# EAGLE schematic VU_meter (EAGLE 7.4.0)
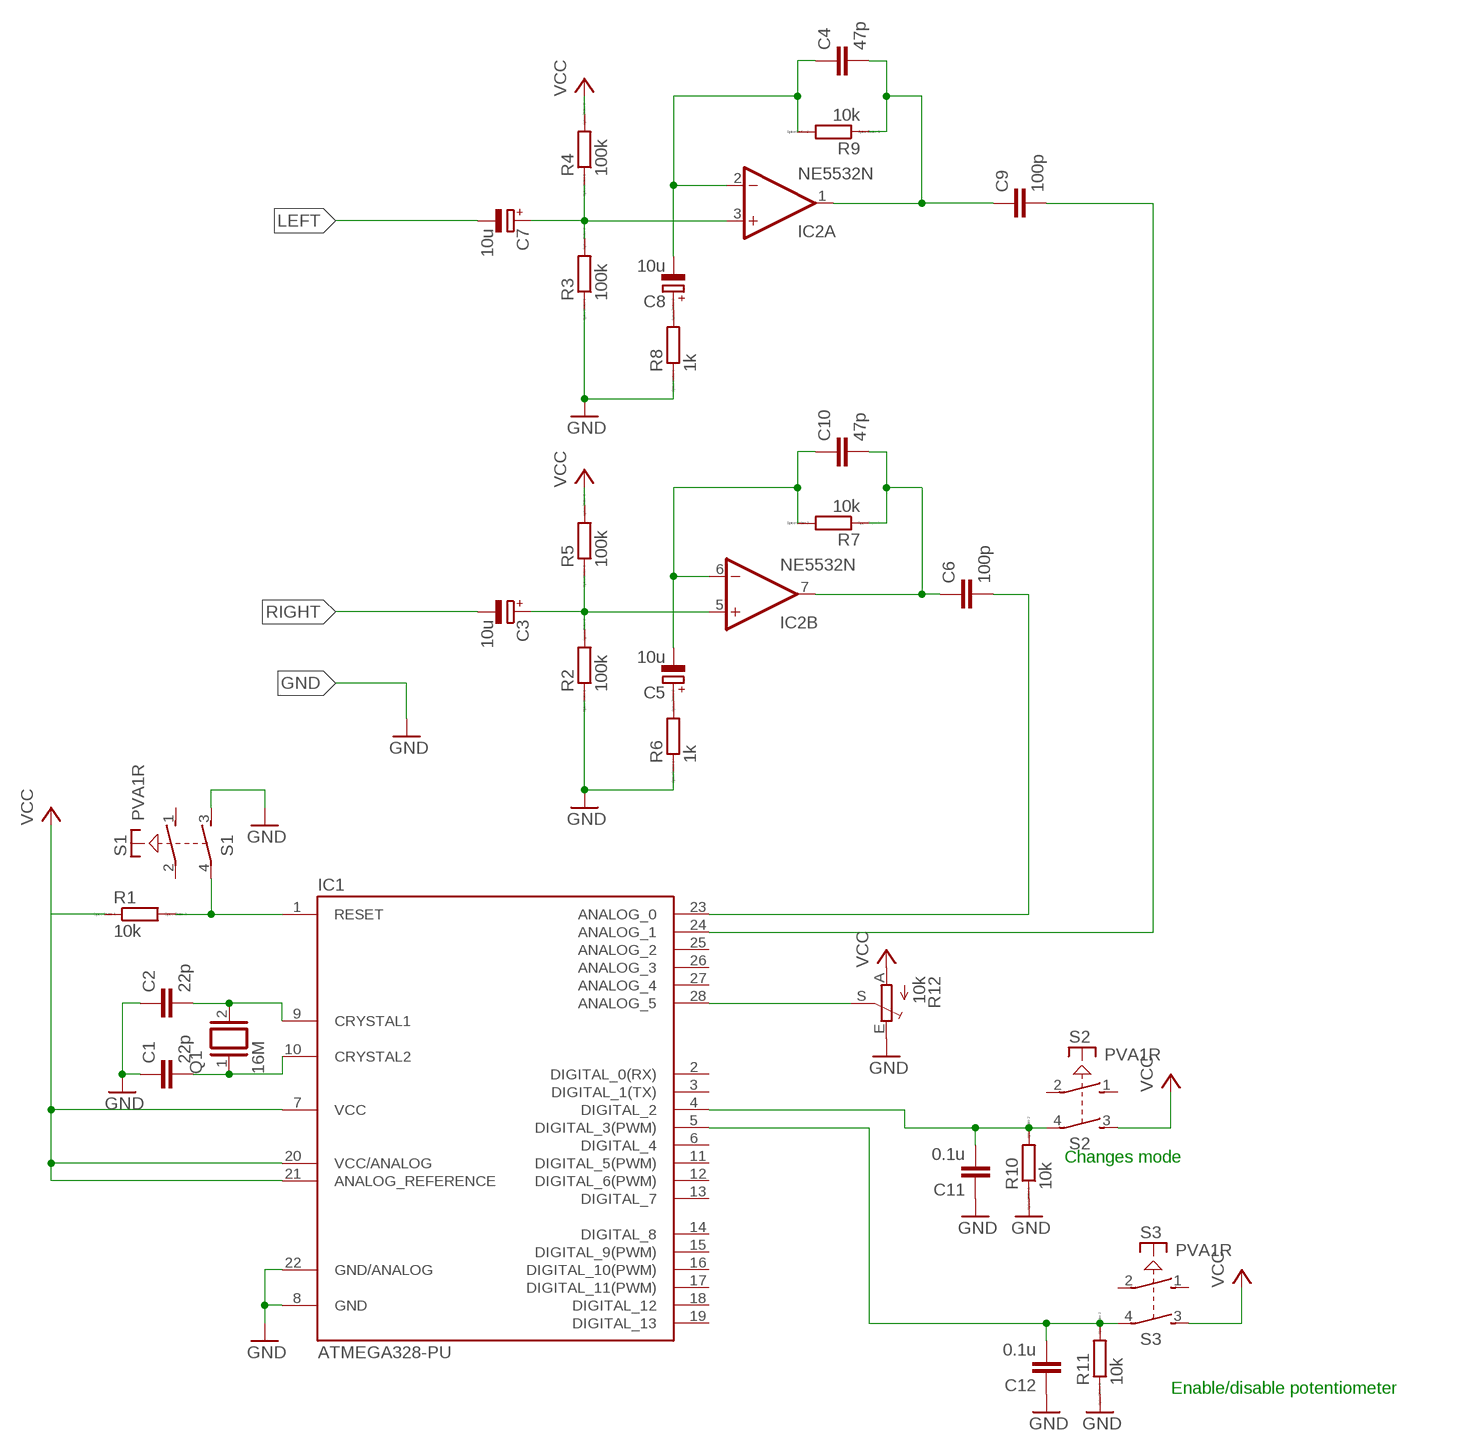
[diagram p0: schematic, sheet 1]

## Parts
C1  22p  C5/5  [C5B5]
C2  22p  C5/5  [C5B5]
C3  10u  CPOL-EUE2-5  [E2-5]
C4  47p  C5/5  [C5B5]
C5  10u  CPOL-EUE2-5  [E2-5]
C6  100p  C5/5  [C5B5]
C7  10u  CPOL-EUE2-5  [E2-5]
C8  10u  CPOL-EUE2-5  [E2-5]
C9  100p  C5/5  [C5B5]
C10  47p  C5/5  [C5B5]
C11  0.1u  C5/5  [C5B5]
C12  0.1u  C5/5  [C5B5]
IC1  ATMEGA328-PU  ATMEGA168-PU  [DIL28-3]
IC2  NE5532N  [DIL08]
Q1  16M  XTAL/S  [QS]
R1  10k  R0207/10  [0207/10]
R2  100k  R0207/10  [0207/10]
R3  100k  R0207/10  [0207/10]
R4  100k  R0207/10  [0207/10]
R5  100k  R0207/10  [0207/10]
R6  1k  R0207/10  [0207/10]
R7  10k  R0207/10  [0207/10]
R8  1k  R0207/10  [0207/10]
R9  10k  R0207/10  [0207/10]
R10  10k  R0207/10  [0207/10]
R11  10k  R0207/10  [0207/10]
R12  10k  TRIM_EU-CIP20C-6MM  [CIP20C-6MM]
S1  PVA1R  [PVA1R]
S2  PVA1R  [PVA1R]
S3  PVA1R  [PVA1R]

## Nets
GND: C1.1 C2.1 C11.1 C12.1 IC1.8(GND) IC1.22(GND/ANALOG) R2.1 R3.1 R6.1 R8.1 R10.1 R11.1 R12.E S1.3(2:S)
LEFT: C7.-
N$1: IC1.1(RESET) R1.2 S1.4(2:P)
N$2: C2.2 IC1.9(CRYSTAL1) Q1.2
N$3: C1.2 IC1.10(CRYSTAL2) Q1.1
N$4: C7.+ IC2.3(A:+IN) R3.2 R4.1
N$5: C3.+ IC2.5(B:+IN) R2.2 R5.1
N$6: C5.+ R6.2
N$7: C6.2 IC1.23(ANALOG_0)
N$8: C5.- C10.1 IC2.6(B:-IN) R7.2
N$9: C4.2 C9.1 IC2.1(A:OUT) R9.1
N$10: C8.+ R8.2
N$11: C4.1 C8.- IC2.2(A:-IN) R9.2
N$12: C9.2 IC1.24(ANALOG_1)
N$13: C6.1 C10.2 IC2.7(B:OUT) R7.1
N$14: C11.2 IC1.4(DIGITAL_2) R10.2 S2.4(2:P)
N$16: C12.2 IC1.5(DIGITAL_3(PWM)) R11.2 S3.4(2:P)
N$17: IC1.28(ANALOG_5) R12.S
RIGHT: C3.-
VCC: IC1.7(VCC) IC1.20(VCC/ANALOG) IC1.21(ANALOG_REFERENCE) R1.1 R4.2 R5.2 R12.A S2.3(2:S) S3.3(2:S)
Unconnected: IC1.2(DIGITAL_0(RX)) IC1.3(DIGITAL_1(TX)) IC1.6(DIGITAL_4) IC1.11(DIGITAL_5(PWM)) IC1.12(DIGITAL_6(PWM)) IC1.13(DIGITAL_7) IC1.14(DIGITAL_8) IC1.15(DIGITAL_9(PWM)) IC1.16(DIGITAL_10(PWM)) IC1.17(DIGITAL_11(PWM)) IC1.18(DIGITAL_12) IC1.19(DIGITAL_13) IC1.25(ANALOG_2) IC1.26(ANALOG_3) IC1.27(ANALOG_4) S1.1(1:S) S1.2(1:P) S2.1(1:S) S2.2(1:P) S3.1(1:S) S3.2(1:P)

## Notes on the sheet
- Changes mode
- Enable/disable potentiometer

## Power pins joined to a net without a drawn wire
V+: IC2.8(P:V+)
V-: IC2.4(P:V-)

## Library data of the parts
C1 C2 C4 C6 C9-C12 = capacitor-wima:C: CAPACITOR naming: grid - package width
C3 C5 C7 C8 = resistor:CPOL-EU: POLARIZED CAPACITOR, European symbol
IC1 = Arduino-AVR:ATMEGA168-PU
IC2 = linear:NE5532: AUDIO AMPLIFIER
Q1 = special:XTAL/S: CRYSTAL
R1-R11 = eagle-ltspice:R: RESISTOR, European symbol; SPICEMODEL: NONE; SPICEPREFIX: R
R12 = pot:TRIM_EU-: POTENTIOMETER
S1-S3 = switch-misc:PVA1R: ITT SWITCH